# Altium schematic sheet DW1000.SchDoc
size A
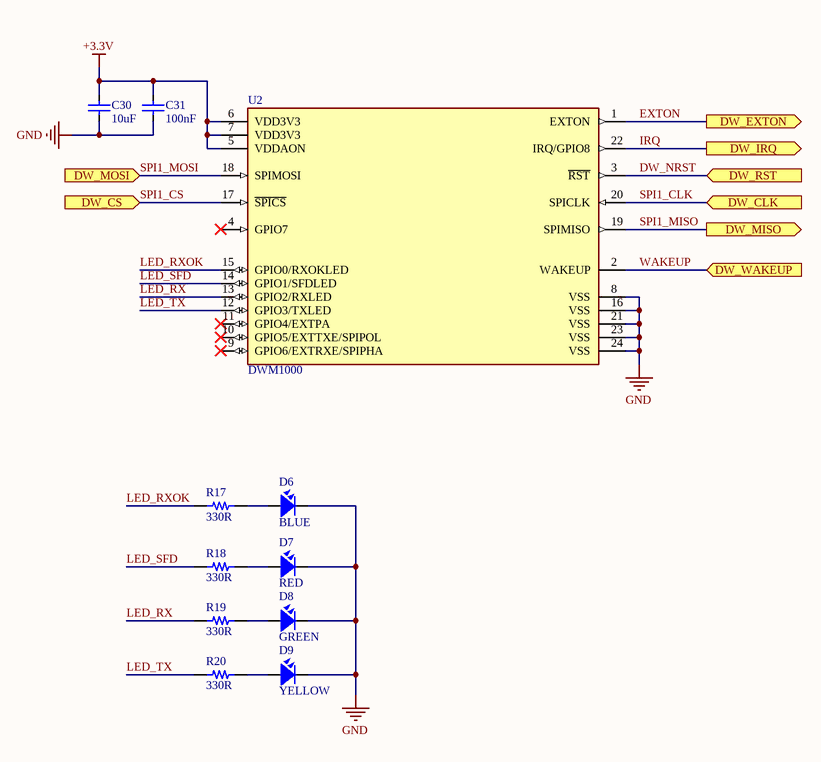
[diagram p0: DW1000.SchDoc]

## Parts
C30  10uF  [CAP_0603]
C31  100nF  [CAP_0603]
D6  BLUE  [LED-0603-Green]
D7  RED  [LED-0603-Red]
D8  GREEN  [LED-0603-Green]
D9  YELLOW  [LED-0603-Green]
R17  330R  [RES-SMD-0603]
R18  330R  [RES-SMD-0603]
R19  330R  [RES-SMD-0603]
R20  330R  [RES-SMD-0603]
U2  DWM1000  [DW1000]

## Ports
DW_CLK (in), DW_CS (in), DW_EXTON (out), DW_IRQ (out), DW_MISO (out), DW_MOSI (in), DW_RST (in), DW_WAKEUP (in)

## Nets
+3.3V: C30.2 C31.2 U2.5(VDDAON) U2.6(VDD3V3) U2.7(VDD3V3)
GND: C30.1 C31.1 D6.2 D7.2 D8.2 D9.2 U2.8(VSS) U2.16(VSS) U2.21(VSS) U2.23(VSS) U2.24(VSS)
DW_NRST: U2.3(~{RST}) ; port DW_RST
EXTON: U2.1(EXTON) ; port DW_EXTON
IRQ: U2.22(IRQ/GPIO8) ; port DW_IRQ
LED_RX: R19.2 U2.13(GPIO2/RXLED)
LED_RXOK: R17.2 U2.15(GPIO0/RXOKLED)
LED_SFD: R18.2 U2.14(GPIO1/SFDLED)
LED_TX: R20.2 U2.12(GPIO3/TXLED)
SPI1_CLK: U2.20(SPICLK) ; port DW_CLK
SPI1_CS: U2.17(~{SPICS}) ; port DW_CS
SPI1_MISO: U2.19(SPIMISO) ; port DW_MISO
SPI1_MOSI: U2.18(SPIMOSI) ; port DW_MOSI
WAKEUP: U2.2(WAKEUP) ; port DW_WAKEUP
NetD6_1: D6.1 R17.1
NetD7_1: D7.1 R18.1
NetD8_1: D8.1 R19.1
NetD9_1: D9.1 R20.1

Not connected (* = marked no-connect by the designer): U2 4(GPIO7)* 9(GPIO6/EXTRXE/SPIPHA)* 10(GPIO5/EXTTXE/SPIPOL)* 11(GPIO4/EXTPA)*

## Library data of the parts
C30 C31 = CapSMD: Capacitor; Value: 33p; Published: 8-Jun-2000; LatestRevisionDate: 17-Jul-2002; LatestRevisionNote: Re-released for DXP Platform.; PackageReference: RAD-0.3; Publisher: Altium Limited
D6-D9 = LED: LED Single colour Green and Red; Value: LED 3 ly Single Colour
R17-R20 = Resistor - SMD: Resistor; Manufacturer: Generic Components; Class: Passive; Published: 08/06/2000; Publisher: Altium Hobart Technology Centre
U2 = DWM1000: Decawave's DW1000 Ultra / Wideband (UWB) transceiver IC